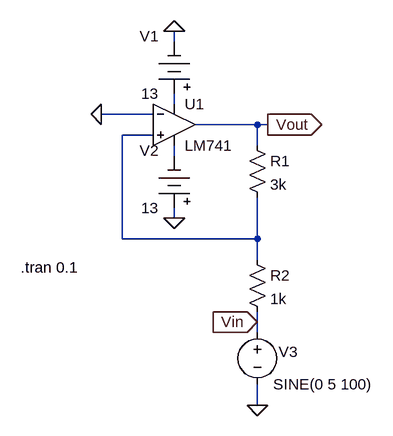
[diagram p0: schematic Draft3.asc]
Draft3.asc, the LTspice schematic file:
Version 4
SHEET 1 1308 680
WIRE 240 16 240 0
WIRE 240 112 240 96
WIRE 208 128 128 128
WIRE 368 144 272 144
WIRE 384 144 368 144
WIRE 208 160 160 160
WIRE 368 176 368 144
WIRE 240 192 240 176
WIRE 240 288 240 272
WIRE 160 320 160 160
WIRE 368 320 368 256
WIRE 368 320 160 320
WIRE 368 352 368 320
WIRE 368 448 368 432
WIRE 368 464 368 448
WIRE 368 576 368 544
FLAG 240 288 0
FLAG 240 0 0
FLAG 128 128 0
FLAG 384 144 Vout
IOPIN 384 144 Out
FLAG 368 448 Vin
IOPIN 368 448 In
FLAG 368 576 0
SYMBOL OpAmps\\LM741 240 80 R0
SYMATTR InstName U1
SYMBOL Misc\\battery 240 112 R180
WINDOW 0 24 104 Left 2
WINDOW 3 24 16 Left 2
WINDOW 123 0 0 Left 0
WINDOW 39 0 0 Left 0
SYMATTR InstName V1
SYMATTR Value 13
SYMBOL Misc\\battery 240 288 R180
WINDOW 0 24 104 Left 2
WINDOW 3 24 16 Left 2
WINDOW 123 0 0 Left 0
WINDOW 39 0 0 Left 0
SYMATTR InstName V2
SYMATTR Value 13
SYMBOL res 352 336 R0
SYMATTR InstName R2
SYMATTR Value 1k
SYMBOL res 352 160 R0
SYMATTR InstName R1
SYMATTR Value 3k
SYMBOL voltage 368 448 R0
WINDOW 0 33 46 Left 2
WINDOW 123 0 0 Left 0
WINDOW 39 0 0 Left 0
SYMATTR InstName V3
SYMATTR Value SINE(0 5 100)
TEXT 4 364 Left 2 !.tran 0.1

The netlist it stands for:
* Draft3.asc
XU1 N002 0 N001 N003 Vout LM741  ; pins In+ In- V+ V- OUT
V1 N001 0 13
V2 0 N003 13
R2 N002 Vin 1k
R1 Vout N002 3k
V3 Vin 0 SINE(0 5 100)
.tran 0.1
.lib LM741.lib
.backanno
.end